# Altium schematic sheet MCU_Signals.SchDoc
size A4
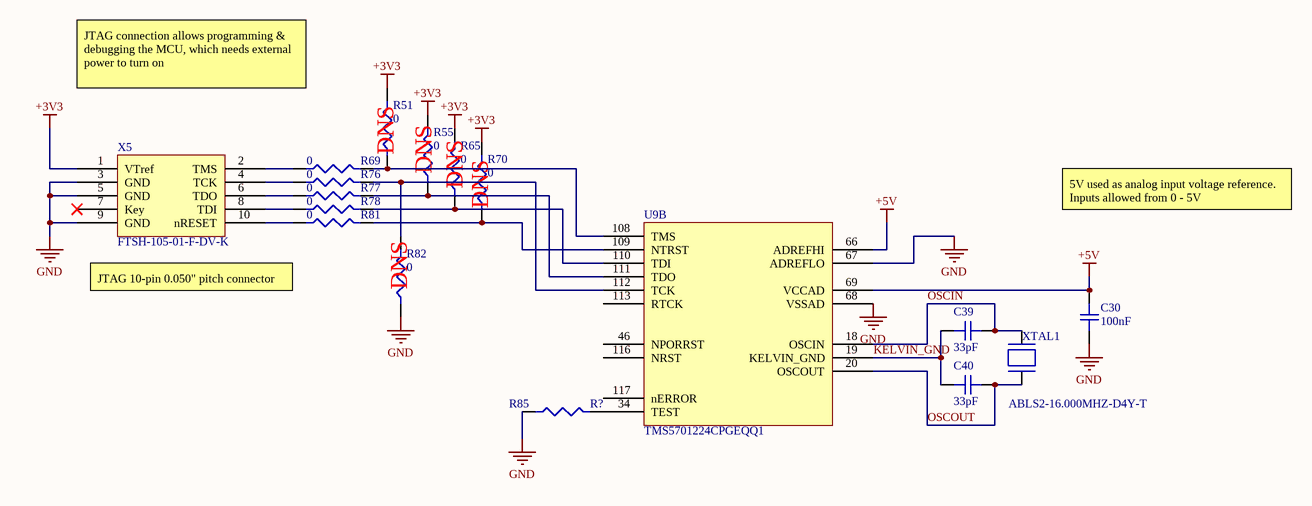
[diagram p0: MCU_Signals.SchDoc]

## Parts
C30  100nF  [C0805]
C39  33pF  [C0805]
C40  33pF  [C0805]
R51  0  [R0805]
R55  0  [R0805]
R65  0  [R0805]
R69  0  [R0805]
R70  0  [R0805]
R76  0  [R0805]
R77  0  [R0805]
R78  0  [R0805]
R81  0  [R0805]
R82  0  [R0805]
R85  R?  [R0805]
U9  TMS5701224CPGEQQ1  [LQFP-144]  (part B of 3)
X5  FTSH-105-01-F-DV-K
XTAL1  ABLS2-16.000MHZ-D4Y-T  [XTAL]

## Nets
+3V3: R51.2 R55.2 R65.2 R70.2 X5.1(VTref)
+5V: C30.2 U9.66(ADREFHI) U9.69(VCCAD)
GND: C30.1 R82.1 R85.1 U9.67(ADREFLO) U9.68(VSSAD) X5.3(GND) X5.5(GND) X5.9(GND)
KELVIN_GND: C39.1 C40.1 U9.19(KELVIN_GND)
OSCIN: C39.2 U9.18(OSCIN) XTAL1.1
OSCOUT: C40.2 U9.20(OSCOUT) XTAL1.2
NetR51_1: R51.1 R69.2 U9.108(TMS)
NetR55_1: R55.1 R77.2 U9.111(TDO)
NetR65_1: R65.1 R78.2 U9.110(TDI)
NetR69_1: R69.1 X5.2(TMS)
NetR70_1: R70.1 R81.2 U9.109(NTRST)
NetR76_1: R76.1 X5.4(TCK)
NetR76_2: R76.2 R82.2 U9.112(TCK)
NetR77_1: R77.1 X5.6(TDO)
NetR78_1: R78.1 X5.8(TDI)
NetR81_1: R81.1 X5.10(nRESET)
NetR85_2: R85.2 U9.34(TEST)

Not connected (* = marked no-connect by the designer): U9 46(NPORRST) 113(RTCK) 116(NRST) 117(nERROR); X5 7(Key)*

## Notes on the sheet
- JTAG connection allows programming & debugging the MCU, which needs external power to turn on
- (near R51) DNS
- (near R55) DNS
- (near R65) DNS
- (near R70) DNS
- 5V used as analog input voltage reference. Inputs allowed from 0 - 5V
- JTAG 10-pin 0.050" pitch connector
- (near R82) DNS

## Library data of the parts
C30 = GRM21B7U1A104JA01L: MLCC SMD CAP 100nF 10Volts U2J 5%; Manufacturer: Murata; Voltage Rating: 10V; Supplier 1: Digi-Key; Manufacturer Part Number: GRM21B7U1A104JA01L; Stock 1: 6000; Pricing 1: 1=0.46, 10=0.32, 100=0.192, 500=0.144, 1000=0.1216 (USD); Mount: Surface Mount; Case/Package: 0805; Case Code (Imperial): 0805; Case Code (Metric): 2012; Min Operating Temperature: -55°C; Max Operating Temperature: 125°C; Capacitance: 100nF; Voltage Rating (DC): 10V; Tolerance: 5%; Packaging: Tape and Reel; Package Quantity: 3000; Dielectric: U2J; Termination: SMD/SMT; Length: 2mm; Height: 1.25mm; Width: 0.049inch; Thickness: 0.053inch; Depth: 1.25mm; Radiation Hardening: No; ComponentLink1URL: https://datasheet.ciiva.com/5424/product-5424660.pdf; ComponentLink1Description: https://datasheet.ciiva.com/5424/product-5424660.pdf; ComponentLink2URL: https://datasheet.ciiva.com/17451/product-17451845.pdf; ComponentLink2Description: https://datasheet.ciiva.com/17451/product-17451845.pdf; ComponentLink3URL: https://datasheet.ciiva.com/11618/product-11618924.pdf; ComponentLink3Description: https://datasheet.ciiva.com/11618/product-11618924.pdf; Supplier Part Number 1: 490-11592-6-ND
C39 C40 = 885012007003: 33pF 10V Ceramic Capacitor C0G, NP0 0805 (2012 Metric) 0.079" L x 0.049" W (2.00mm x 1.25mm); Manufacturer: Wurth Electronics; Tolerance: 5%; Supplier 1: Digi-Key; Manufacturer Part Number: 885012007003; Stock 1: 3090; Pricing 1: 1=0.1, 50=0.068, 100=0.062, 250=0.056, 500=0.05, 1000=0.045 (USD); Mount: Surface Mount; Case/Package: 0805; Case Code (Metric): 2012; Case Code (Imperial): 0805; Min Operating Temperature: -55°C; Max Operating Temperature: 125°C; Packaging: Tape and Reel; Capacitance: 33pF; Voltage Rating: 10V; Length: 0.079inch; Width: 0.049inch; Thickness: 0.028inch; Supplier Part Number 1: 732-7808-1-ND
R51 R55 R65 R69 R70 R76-R78 R81 R82 = RC0805JR-070RL: RES SMD 0 OHM 1/8W 0805; Manufacturer: Yageo; Resistance: 0mR; Tolerance: 5%; Voltage Rating: 150V; Power Rating: 125mW; Temperature Coefficient: 200ppm/°C; Supplier 1: Digi-Key; Manufacturer Part Number: RC0805JR-070RL; Stock 1: 5922085; Pricing 1: 1=0.1, 10=0.018, 25=0.0128, 50=0.0096, 100=0.0071, 250=0.0054, 500=0.0044, 1000=0.0032 (USD); Case/Package: 0805; Number of Pins: 2; Case Code (Imperial): 0805; Case Code (Metric): 2012; Contact Plating: Tin,Matte; Min Operating Temperature: -55°C; Max Operating Temperature: 155°C; Packaging: Tape and Reel; Voltage Rating (DC): 150V; Termination: SMD/SMT; Composition: Thick Film; Military Standard: Not; Length: 2mm; Height: 0.5mm; Width: 1.25mm; Depth: 1.25mm; Radiation Hardening: No; REACH SVHC: Unknown; Lead Free: Lead Free; ComponentLink1URL: https://datasheet.ciiva.com/7941/1738694-7941861.pdf; ComponentLink1Description: https://datasheet.ciiva.com/7941/1738694-7941861.pdf; ComponentLink2URL: https://datasheet.ciiva.com/7941/1738694-7941862.pdf; ComponentLink2Description: https://datasheet.ciiva.com/7941/1738694-7941862.pdf; ComponentLink3URL: https://datasheet.ciiva.com/11819/0900766b8106beab-11819430.pdf; ComponentLink3Description: https://datasheet.ciiva.com/11819/0900766b8106beab-11819430.pdf; ComponentLink4URL: https://datasheet.ciiva.com/7941/1738694-7941863.pdf; ComponentLink4Description: https://datasheet.ciiva.com/7941/1738694-7941863.pdf; ComponentLink5URL: https://datasheet.ciiva.com/15190/getdatasheetpartid-330685-15190028.pdf; ComponentLink5Description: https://datasheet.ciiva.com/15190/getdatasheetpartid-330685-15190028.pdf; Supplier Part Number 1: 311-0.0ARDKR-ND
R85 = RC0805JR-072K2L: RES SMD 2.2K OHM 5% 1/8W; Manufacturer: Yageo; Resistance: 2.2kR; Temperature Coefficient: 100ppm/°C; Power Rating: 125mW; Voltage Rating: 150V; Supplier 1: Digi-Key; Manufacturer Part Number: RC0805JR-072K2L; Stock 1: 810523; Pricing 1: 1=0.1, 10=0.019, 100=0.0076, 1000=0.0034, 2500=0.003 (USD); Case/Package: 0805; Contact Plating: Tin,Lead,Matte; Case Code (Imperial): 0805; Case Code (Metric): 2012; Min Operating Temperature: -55°C; Max Operating Temperature: 155°C; Tolerance: 5%; Packaging: Tape and Reel; Composition: Thick Film; Termination: SMD/SMT; Military Standard: Not; Length: 2mm; Depth: 1.25mm; Radiation Hardening: No; REACH SVHC: Unknown; Lead Free: Lead Free; ComponentLink1URL: https://datasheet.ciiva.com/12667/rc0805-12667397.pdf; ComponentLink1Description: https://datasheet.ciiva.com/12667/rc0805-12667397.pdf; ComponentLink2URL: https://datasheet.ciiva.com/15190/getdatasheetpartid-251869-15190044.pdf; ComponentLink2Description: https://datasheet.ciiva.com/15190/getdatasheetpartid-251869-15190044.pdf; ComponentLink3URL: https://datasheet.ciiva.com/7941/442941-7941935.pdf; ComponentLink3Description: https://datasheet.ciiva.com/7941/442941-7941935.pdf; Supplier Part Number 1: 311-2.2KARCT-ND
U9 = TMS5701224CPGEQQ1: ARM CORTEX R4 LOCK STEP HERCULES MCU; Manufacturer: Texas Instruments; Frequency: 160MHz; Interface: I2C,SPI,CAN,UART,USART,LIN,SCI,EBI/EMI; Number of I/Os: 64; Oscillator Type: External; RAM Size: 192KB; Number of Timers/Counters: 2; Watchdog Timer: Yes; Memory Type: FLASH; Memory Size: 1.25MB; Density: 1310720B; Peripherals: POR,PWM,WDT,DMA; Supplier 1: Digi-Key; Manufacturer Part Number: TMS5701224CPGEQQ1; Stock 1: 113; Pricing 1: 1=22.12, 10=20.402, 100=17.4222, 500=15.8176 (USD); Case/Package: LQFP; Number of Pins: 144; Min Operating Temperature: -40°C; Max Operating Temperature: 125°C; Packaging: Tray; Number of Programmable I/O: 64; Max Frequency: 160MHz; Number of GPIO: 64; Core Architecture: ARM; Lead Free: Lead Free; ComponentLink1URL: http://www.ti.com/lit/pdf/spnu515; ComponentLink1Description: http://www.ti.com/lit/pdf/spnu515; ComponentLink2URL: http://www.ti.com/lit/gpn/tms570ls1224; ComponentLink2Description: http://www.ti.com/lit/gpn/tms570ls1224; ComponentLink3URL: http://www.ti.com/general/docs/lit/getliterature.tsp?genericPartNumber=TMS570LS1224&&fileType=pdf; ComponentLink3Description: http://www.ti.com/general/docs/lit/getliterature.tsp?genericPartNumber=TMS570LS1224&&fileType=pdf; Supplier Part Number 1: 296-47200-ND
X5 = FTSH-105-01-F-DV-K: .050 Connector Dual Header 10 Position Surface Mount; Manufacturer: Samtec; Max Current Rating: 1.75A; Number of Positions: 10; Connector Type: Male Pin; Pitch: 1.27mm; Row Spacing: 0.05inch; Supplier 1: Digi-Key; Manufacturer Part Number: FTSH-105-01-F-DV-K; Stock 1: 18199; Pricing 1: 1=2.9, 10=2.784, 100=2.32, 500=1.972, 1000=1.682, 5000=1.508 (USD); Mount: Surface Mount; Contact Material: Bronze,Copper; Contact Plating: Nickel,Gold; Colour: Black; Housing Colour: Black; Housing Material: Polymer; Min Operating Temperature: -55°C; Max Operating Temperature: 125°C; Number of Rows: 2; Packaging: Rail/Tube; Package Quantity: 1; Termination: Solder; Number of Contacts: 10; Orientation: Straight; Length: 15.2mm; Height: 3.3mm; Contact Mating Length: 0.12inch; Depth: 3.43mm; Radiation Hardening: No; Lead Free: Lead Free; ComponentLink1URL: https://datasheet.ciiva.com/19461/2046846-19461026.pdf; ComponentLink1Description: https://datasheet.ciiva.com/19461/2046846-19461026.pdf; ComponentLink2URL: https://datasheet.ciiva.com/738/ftsh-1xx-xx-xxx-dv-xxx-mkt-738998.pdf; ComponentLink2Description: https://datasheet.ciiva.com/738/ftsh-1xx-xx-xxx-dv-xxx-mkt-738998.pdf; ComponentLink3URL: https://datasheet.ciiva.com/10245/ftsh-mt-10245273.pdf; ComponentLink3Description: https://datasheet.ciiva.com/10245/ftsh-mt-10245273.pdf; ComponentLink4URL: https://datasheet.ciiva.com/16657/ftsh-mt-16657371.pdf; ComponentLink4Description: https://datasheet.ciiva.com/16657/ftsh-mt-16657371.pdf; ComponentLink5URL: https://datasheet.ciiva.com/15195/getdatasheetpartid-133463-15195260.pdf; ComponentLink5Description: https://datasheet.ciiva.com/15195/getdatasheetpartid-133463-15195260.pdf; Supplier Part Number 1: SAM8796-ND
XTAL1 = ABLS2-16.000MHZ-D4Y-T: 16MHz ±30ppm Crystal 18pF 40 Ohm -40°C ~ 85°C  Surface Mount HC49/US; Manufacturer: Abracon; ESR (Equivalent Series Resistance): 40R; Supplier 1: Digi-Key; Manufacturer Part Number: ABLS2-16.000MHZ-D4Y-T; Stock 1: 14083; Pricing 1: 1=0.46, 10=0.385, 50=0.3466, 100=0.308, 500=0.2926 (USD); Mount: Surface Mount; Min Operating Temperature: -40°C; Max Operating Temperature: 85°C; Package Quantity: 1000; Frequency: 16MHz; Frequency Tolerance: 30ppm; Load Capacitance: 18pF; Packaging: Tape and Reel; Tolerance: 30ppm; Frequency Stability: 30ppm; Termination: SMD/SMT; Series Resistance: 40R; Length: 11.05mm; Height: 0.13inch; Width: 0.185inch; Depth: 4.8mm; REACH SVHC: Unknown; Lead Free: Lead Free; ComponentLink1URL: https://datasheet.ciiva.com/854/abls2-854400.pdf; ComponentLink1Description: https://datasheet.ciiva.com/854/abls2-854400.pdf; ComponentLink2URL: https://datasheet.ciiva.com/854/abls2-854401.pdf; ComponentLink2Description: https://datasheet.ciiva.com/854/abls2-854401.pdf; ComponentLink3URL: https://datasheet.ciiva.com/15116/getdatasheetpartid-719900-15116780.pdf; ComponentLink3Description: https://datasheet.ciiva.com/15116/getdatasheetpartid-719900-15116780.pdf; ComponentLink4URL: https://datasheet.ciiva.com/854/abls2-854399.pdf; ComponentLink4Description: https://datasheet.ciiva.com/854/abls2-854399.pdf; Supplier Part Number 1: 535-9875-1-ND